# Altium schematic sheet Steering Wheel Schematic.SchDoc
size 447 x 345 mm; SheetNumber: 1; SheetTotal: 1
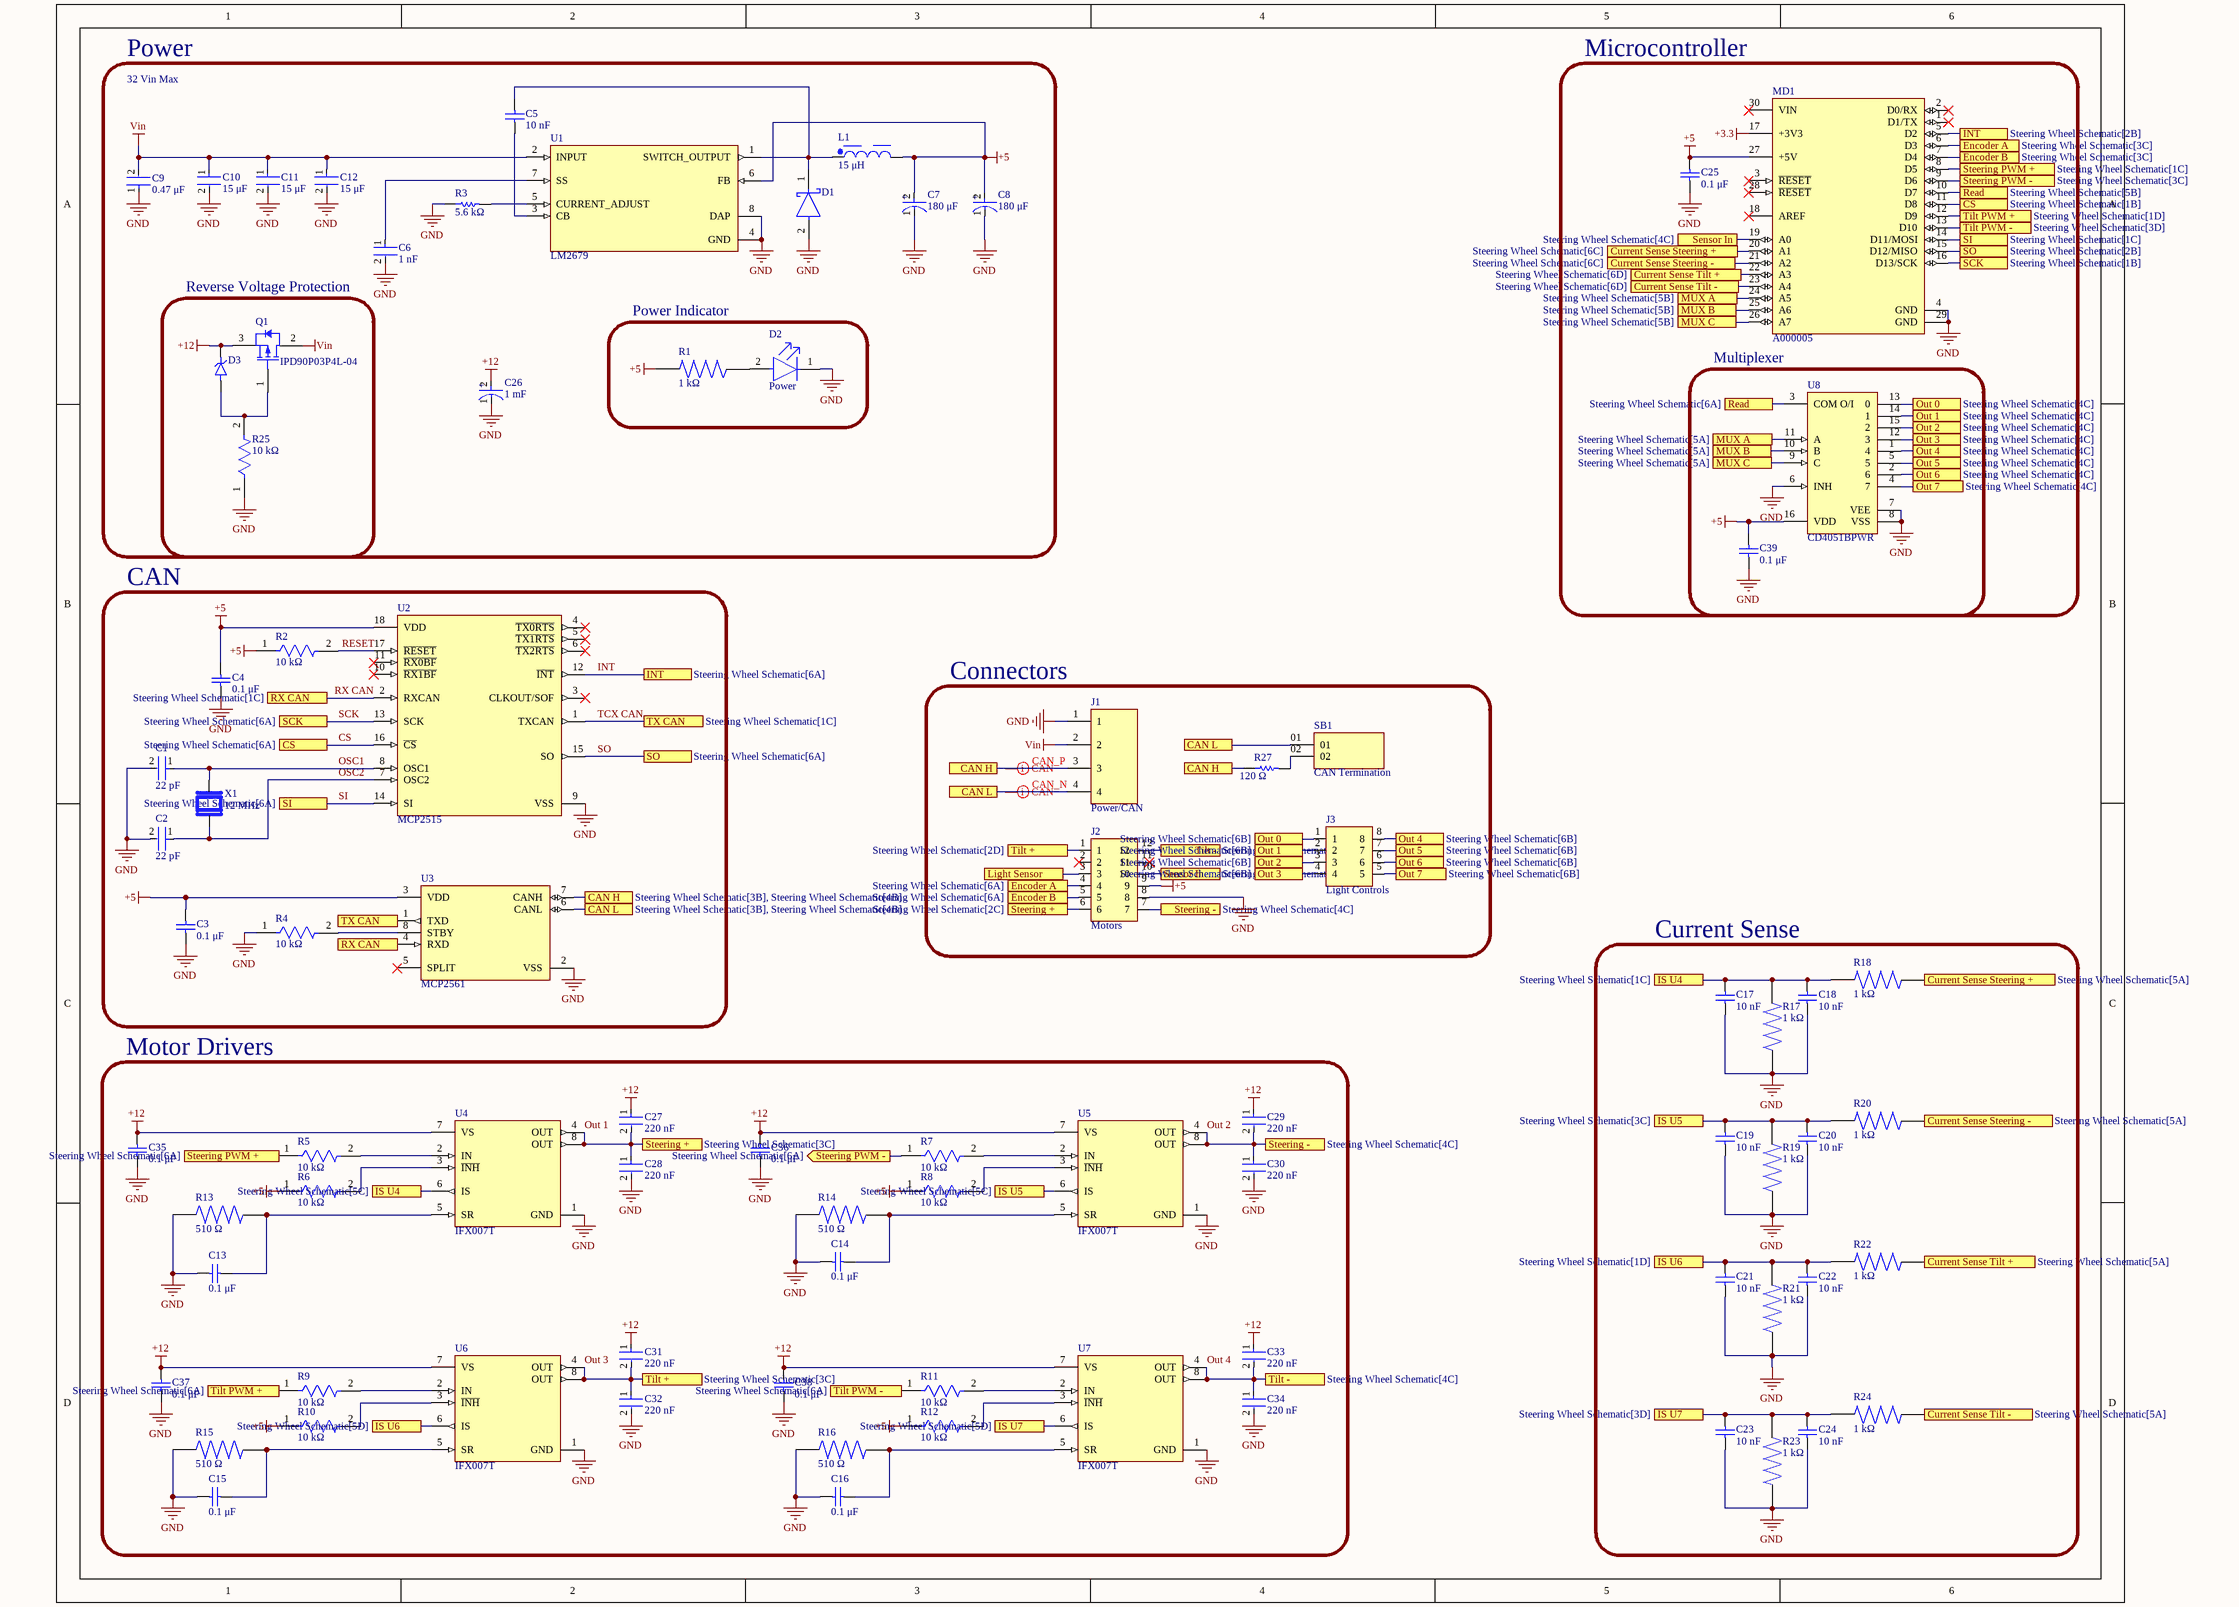
[diagram p0: Steering Wheel Schematic.SchDoc]

## Parts
C1  22 pF  [FP-CL31-IPC_A]
C2  22 pF  [FP-CL31-IPC_A]
C3  0.1 μF  [KEMT-1206-2_M]
C4  0.1 μF  [KEMT-1206-2_M]
C5  10 nF  [WCAP-CSGP_1206_L3.2W1.6H0.8]
C6  1 nF  [FP-C1206C-EF-MFG]
C7  180 μF  [FP-OS-CON-SMT-C6-MFG]
C8  180 μF  [FP-OS-CON-SMT-C6-MFG]
C9  0.47 μF  [FP-C2012-125-0_2-MFG]
C10  15 μF  [FP-C3216-160-0_2-IPC_A]
C11  15 μF  [FP-C3216-160-0_2-IPC_A]
C12  15 μF  [FP-C3216-160-0_2-IPC_A]
C13  0.1 μF  [KEMT-1206-2_M]
C14  0.1 μF  [KEMT-1206-2_M]
C15  0.1 μF  [KEMT-1206-2_M]
C16  0.1 μF  [KEMT-1206-2_M]
C17  10 nF  [WCAP-CSGP_1206_L3.2W1.6H0.8]
C18  10 nF  [WCAP-CSGP_1206_L3.2W1.6H0.8]
C19  10 nF  [WCAP-CSGP_1206_L3.2W1.6H0.8]
C20  10 nF  [WCAP-CSGP_1206_L3.2W1.6H0.8]
C21  10 nF  [WCAP-CSGP_1206_L3.2W1.6H0.8]
C22  10 nF  [WCAP-CSGP_1206_L3.2W1.6H0.8]
C23  10 nF  [WCAP-CSGP_1206_L3.2W1.6H0.8]
C24  10 nF  [WCAP-CSGP_1206_L3.2W1.6H0.8]
C25  0.1 μF  [KEMT-1206-2_M]
C26  1 mF  [FP-FKH13-MFG]
C27  220 nF  [FP-CL31-IPC_C]
C28  220 nF  [FP-CL31-IPC_C]
C29  220 nF  [FP-CL31-IPC_C]
C30  220 nF  [FP-CL31-IPC_C]
C31  220 nF  [FP-CL31-IPC_C]
C32  220 nF  [FP-CL31-IPC_C]
C33  220 nF  [FP-CL31-IPC_C]
C34  220 nF  [FP-CL31-IPC_C]
C35  0.1 μF  [KEMT-1206-2_M]
C36  0.1 μF  [KEMT-1206-2_M]
C37  0.1 μF  [KEMT-1206-2_M]
C38  0.1 μF  [KEMT-1206-2_M]
C39  0.1 μF  [KEMT-1206-2_M]
D1  (no value)  [FP-SOD128-MFG]
D2  Power  [FP-LTST-C190GKT-MFG]
D3  (no value)  [DIOM4325X244N]
J1  Power/CAN  [TE_DT13-4P]
J2  Motors  [TE_DT13-12PA]
J3  Light Controls  [TE_DT13-08PB]
L1  15 μH  [WE-PD_1210]
MD1  A000005  [FP-A000005-MFG]
Q1  IPD90P03P4L-04  [INF-PG-TO252-3-11_M]
R1  1 kΩ  [RESC3116X65N]
R2  10 kΩ  [FP-RMCF1206-IPC_B]
R3  5.6 kΩ  [RESC1206(3216)_L]
R4  10 kΩ  [FP-RMCF1206-IPC_B]
R5  10 kΩ  [FP-RMCF1206-IPC_B]
R6  10 kΩ  [FP-RMCF1206-IPC_B]
R7  10 kΩ  [FP-RMCF1206-IPC_B]
R8  10 kΩ  [FP-RMCF1206-IPC_B]
R9  10 kΩ  [FP-RMCF1206-IPC_B]
R10  10 kΩ  [FP-RMCF1206-IPC_B]
R11  10 kΩ  [FP-RMCF1206-IPC_B]
R12  10 kΩ  [FP-RMCF1206-IPC_B]
R13  510 Ω  [RESC3216X70N]
R14  510 Ω  [RESC3216X70N]
R15  510 Ω  [RESC3216X70N]
R16  510 Ω  [RESC3216X70N]
R17  1 kΩ  [RESC3116X65N]
R18  1 kΩ  [RESC3116X65N]
R19  1 kΩ  [RESC3116X65N]
R20  1 kΩ  [RESC3116X65N]
R21  1 kΩ  [RESC3116X65N]
R22  1 kΩ  [RESC3116X65N]
R23  1 kΩ  [RESC3116X65N]
R24  1 kΩ  [RESC3116X65N]
R25  10 kΩ  [FP-RMCF1206-IPC_B]
R27  120 Ω  [RESC3116X65X40LL10T20]
SB1  CAN Termination  [SAMTEC_TS-102-T-A-2]
U1  LM2679  [VREG_LM2679SX-5.0/NOPB]
U2  MCP2515  [FP-C04-051-MFG]
U3  MCP2561  [FP-C04-057-SN-MFG]
U4  IFX007T  [FP-PG-TO263-7-MFG]
U5  IFX007T  [FP-PG-TO263-7-MFG]
U6  IFX007T  [FP-PG-TO263-7-MFG]
U7  IFX007T  [FP-PG-TO263-7-MFG]
U8  CD4051BPWR  [PW0016A_M]
X1  12 MHz  [XTAL_ABLS7M-12.000MHZ-B-2-T]

## Blocks framed on the sheet
Power: C5-C12 C26 D1 L1 R3 U1
Microcontroller: C25 MD1
Reverse Voltage Protection: D3 Q1 R25
Power Indicator: D2 R1
Multiplexer: C39 U8
CAN: C1-C4 R2 R4 U2 U3 X1
Connectors: J1-J3 R27 SB1
Current Sense: C17-C24 R17-R24
Motor Drivers: C13-C16 C27-C38 R5-R16 U4-U7

## Ports
CAN H (see Steering Wheel Schematic[2C], Steering Wheel Schematic[3B]), CAN H (see Steering Wheel Schematic[2C], Steering Wheel Schematic[4B]), CAN H (see Steering Wheel Schematic[3B], Steering Wheel Schematic[4B]), CAN L (see Steering Wheel Schematic[2C], Steering Wheel Schematic[3B]), CAN L (see Steering Wheel Schematic[2C], Steering Wheel Schematic[4B]), CAN L (see Steering Wheel Schematic[3B], Steering Wheel Schematic[4B]), CS (see Steering Wheel Schematic[1B]), CS (see Steering Wheel Schematic[6A]), Current Sense Steering + (see Steering Wheel Schematic[5A]), Current Sense Steering + (see Steering Wheel Schematic[6C]), Current Sense Steering - (see Steering Wheel Schematic[5A]), Current Sense Steering - (see Steering Wheel Schematic[6C]), Current Sense Tilt + (see Steering Wheel Schematic[5A]), Current Sense Tilt + (see Steering Wheel Schematic[6D]), Current Sense Tilt - (see Steering Wheel Schematic[5A]), Current Sense Tilt - (see Steering Wheel Schematic[6D]), Encoder A (see Steering Wheel Schematic[3C]), Encoder A (see Steering Wheel Schematic[6A]), Encoder B (see Steering Wheel Schematic[3C]), Encoder B (see Steering Wheel Schematic[6A]), INT (see Steering Wheel Schematic[2B]), INT (see Steering Wheel Schematic[6A]), IS U4 (see Steering Wheel Schematic[1C]), IS U4 (see Steering Wheel Schematic[5C]), IS U5 (see Steering Wheel Schematic[3C]), IS U5 (see Steering Wheel Schematic[5C]), IS U6 (see Steering Wheel Schematic[1D]), IS U6 (see Steering Wheel Schematic[5D]), IS U7 (see Steering Wheel Schematic[3D]), IS U7 (see Steering Wheel Schematic[5D]), Light Sensor, MUX A (see Steering Wheel Schematic[5A]), MUX A (see Steering Wheel Schematic[5B]), MUX B (see Steering Wheel Schematic[5A]), MUX B (see Steering Wheel Schematic[5B]), MUX C (see Steering Wheel Schematic[5A]), MUX C (see Steering Wheel Schematic[5B]), Out 0 (see Steering Wheel Schematic[4C]), Out 0 (see Steering Wheel Schematic[6B]), Out 1 (see Steering Wheel Schematic[4C]), Out 1 (see Steering Wheel Schematic[6B]), Out 2 (see Steering Wheel Schematic[4C]), Out 2 (see Steering Wheel Schematic[6B]), Out 3 (see Steering Wheel Schematic[4C]), Out 3 (see Steering Wheel Schematic[6B]), Out 4 (see Steering Wheel Schematic[4C]), Out 4 (see Steering Wheel Schematic[6B]), Out 5 (see Steering Wheel Schematic[4C]), Out 5 (see Steering Wheel Schematic[6B]), Out 6 (see Steering Wheel Schematic[4C]), Out 6 (see Steering Wheel Schematic[6B]), Out 7 (see Steering Wheel Schematic[4C]), Out 7 (see Steering Wheel Schematic[6B]), Read (see Steering Wheel Schematic[5B]), Read (see Steering Wheel Schematic[6A]), RX CAN (see Steering Wheel Schematic[1B]), RX CAN (see Steering Wheel Schematic[1C]), SCK (see Steering Wheel Schematic[1B]), SCK (see Steering Wheel Schematic[6A]), Sensor In (see Steering Wheel Schematic[4C]), Sensor In (see Steering Wheel Schematic[5A]), SI (see Steering Wheel Schematic[1C]), SI (see Steering Wheel Schematic[6A]), SO (see Steering Wheel Schematic[2B]), SO (see Steering Wheel Schematic[6A]), Steering + (see Steering Wheel Schematic[2C]), Steering + (see Steering Wheel Schematic[3C]), Steering - (see Steering Wheel Schematic[4C]), Steering PWM + (out, see Steering Wheel Schematic[6A]), Steering PWM + (see Steering Wheel Schematic[1C]), Steering PWM - (out, see Steering Wheel Schematic[6A]), Steering PWM - (see Steering Wheel Schematic[3C]), Tilt + (see Steering Wheel Schematic[2D]), Tilt + (see Steering Wheel Schematic[3C]), Tilt - (see Steering Wheel Schematic[4C]), Tilt - (see Steering Wheel Schematic[4D]), Tilt PWM + (out, see Steering Wheel Schematic[6A]), Tilt PWM + (see Steering Wheel Schematic[1D]), Tilt PWM - (out, see Steering Wheel Schematic[6A]), Tilt PWM - (see Steering Wheel Schematic[3D]), TX CAN (see Steering Wheel Schematic[1C]), TX CAN (see Steering Wheel Schematic[2B])

## Nets
+3.3: MD1.17(+3V3)
+5: C3.2 C4.2 C7.2(A) C8.2(A) C25.2 C39.2 J2.9 L1.2 MD1.27(+5V) R1.2 R2.1 R6.1 R8.1 R10.1 R12.1 U1.6(FB) U2.18(VDD) U3.3(VDD) U8.16(VDD)
+12: C26.2(A) C27.1 C29.1 C31.1 C33.1 C35.1 C36.1 C37.1 C38.1 D3.C(K) Q1.3(SOURCE) U4.7(VS) U5.7(VS) U6.7(VS) U7.7(VS)
GND: C1.2 C2.2 C3.1 C4.1 C6.2 C7.1(C) C8.1(C) C9.1 C10.2 C11.2 C12.2 C13.2 C14.2 C15.2 C16.2 C17.1 C18.1 C19.1 C20.1 C21.1 C22.1 C23.1 C24.1 C25.1 C26.1(C) C28.2 C30.2 C32.2 C34.2 C35.2 C36.2 C37.2 C38.2 C39.1 D1.2(A) D2.1(C) J1.1 J2.8 MD1.4(GND) MD1.29(GND) R3.1 R4.1 R13.1 R14.1 R15.1 R16.1 R17.1 R19.1 R21.1 R23.1 R25.1 U1.4(GND) U1.8(DAP) U2.9(VSS) U3.2(VSS) U4.1(GND) U5.1(GND) U6.1(GND) U7.1(GND) U8.6(INH) U8.7(VEE) U8.8(VSS)
Vin: C9.2 C10.1 C11.1 C12.1 J1.2 Q1.2(DRAIN) U1.2(INPUT)
CAN_N: J1.4 SB1.01 U3.6(CANL) ; port CAN L
CAN_P: J1.3 R27.1 U3.7(CANH) ; port CAN H
CS: MD1.11(D8) U2.16(~{CS}) ; port CS
Current Sense Steering +: MD1.20(A1) R18.1 ; port Current Sense Steering +
Current Sense Steering -: MD1.21(A2) R20.1 ; port Current Sense Steering -
Current Sense Tilt +: MD1.22(A3) R22.1 ; port Current Sense Tilt +
Current Sense Tilt -: MD1.23(A4) R24.1 ; port Current Sense Tilt -
Encoder A: J2.4 MD1.6(D3) ; port Encoder A
Encoder B: J2.5 MD1.7(D4) ; port Encoder B
INT: MD1.5(D2) U2.12(~{INT}) ; port INT
IS U4: C17.2 C18.2 R17.2 R18.2 U4.6(IS) ; port IS U4
IS U5: C19.2 C20.2 R19.2 R20.2 U5.6(IS) ; port IS U5
IS U6: C21.2 C22.2 R21.2 R22.2 U6.6(IS) ; port IS U6
IS U7: C23.2 C24.2 R23.2 R24.2 U7.6(IS) ; port IS U7
Light Sensor: J2.3 ; port Light Sensor
MUX A: MD1.24(A5) U8.11(A) ; port MUX A
MUX B: MD1.25(A6) U8.10(B) ; port MUX B
MUX C: MD1.26(A7) U8.9(C) ; port MUX C
OSC1: C1.1 U2.8(OSC1) X1.2
OSC2: C2.1 U2.7(OSC2) X1.1
Out 0: J3.1 U8.13(0) ; port Out 0
Out 1: C27.2 C28.1 J2.6 U4.4(OUT) U4.8(OUT) ; port Steering +
Out 1: J3.2 U8.14(1) ; port Out 1  [a separate net that carries the same name]
Out 2: C29.2 C30.1 J2.7 U5.4(OUT) U5.8(OUT) ; port Steering -
Out 2: J3.3 U8.15(2) ; port Out 2  [a separate net that carries the same name]
Out 3: C31.2 C32.1 J2.1 U6.4(OUT) U6.8(OUT) ; port Tilt +
Out 3: J3.4 U8.12(3) ; port Out 3  [a separate net that carries the same name]
Out 4: C33.2 C34.1 J2.12 U7.4(OUT) U7.8(OUT) ; port Tilt -
Out 4: J3.8 U8.1(4) ; port Out 4  [a separate net that carries the same name]
Out 5: J3.7 U8.5 ; port Out 5
Out 6: J3.6 U8.2(6) ; port Out 6
Out 7: J3.5 U8.4(7) ; port Out 7
Read: MD1.10(D7) U8.3(COM_O/I) ; port Read
RESET: R2.2 U2.17(~{RESET})
RX CAN: U2.2(RXCAN) U3.4(RXD) ; port RX CAN
SCK: MD1.16(D13/SCK) U2.13(SCK) ; port SCK
Sensor In: J2.10 MD1.19(A0) ; port Sensor In
SI: MD1.14(D11/MOSI) U2.14(SI) ; port SI
SO: MD1.15(D12/MISO) U2.15(SO) ; port SO
Steering PWM +: MD1.8(D5) R5.1 ; port Steering PWM +
Steering PWM -: MD1.9(D6) R7.1 ; port Steering PWM -
TCX CAN: U2.1(TXCAN) U3.1(TXD) ; port TX CAN
Tilt PWM +: MD1.12(D9) R9.1 ; port Tilt PWM +
Tilt PWM -: MD1.13(D10) R11.1 ; port Tilt PWM -
NetC5_1: C5.1 U1.3(CB)
NetC5_2: C5.2 D1.1(C) L1.1 U1.1(SWITCH_OUTPUT)
NetC6_1: C6.1 U1.7(SS)
NetC13_1: C13.1 R13.2 U4.5(SR)
NetC14_1: C14.1 R14.2 U5.5(SR)
NetC15_1: C15.1 R15.2 U6.5(SR)
NetC16_1: C16.1 R16.2 U7.5(SR)
NetD2_2: D2.2(A) R1.1
NetD3_A: D3.A Q1.1(GATE) R25.2
NetR3_2: R3.2 U1.5(CURRENT_ADJUST)
NetR4_2: R4.2 U3.8(STBY)
NetR5_2: R5.2 U4.2(IN)
NetR6_2: R6.2 U4.3(~{INH})
NetR7_2: R7.2 U5.2(IN)
NetR8_2: R8.2 U5.3(~{INH})
NetR9_2: R9.2 U6.2(IN)
NetR10_2: R10.2 U6.3(~{INH})
NetR11_2: R11.2 U7.2(IN)
NetR12_2: R12.2 U7.3(~{INH})
NetR27_2: R27.2 SB1.02

Not connected (* = marked no-connect by the designer): J2 2* 11*; MD1 1(D1/TX)* 2(D0/RX)* 3(~{RESET})* 18(AREF)* 28(~{RESET})* 30(VIN)*; U2 3(CLKOUT/SOF)* 4(~{TX0RTS})* 5(~{TX1RTS})* 6(~{TX2RTS})* 10(~{RX1BF})* 11(~{RX0BF})*; U3 5(SPLIT)*

## Layout directives
differential pair: CAN_N, CAN_P

## Notes on the sheet
- 32 Vin Max
- (in symbol CMP-05427-002158-1) +
- (in symbol CMP-05428-001090-1) +

## Library data of the parts
C1 C2 = CMP-13271-001055-1: CL31C220JBCNNNC; Material: Ceramic; Voltage: 50V; Tolerance: 5%; Dielectric: C0G; Temperature Coefficient: 300ppm/°C; Capacitance: 22pF; Packaging: Tape and Reel; Package Quantity: 1; Thickness: 0.039inch; Height: 0.85mm; Radiation Hardening: No; Mount: Surface Mount; Width: 0.063inch; Min Operating Temperature: -55°C; Max Operating Temperature: 125°C; Voltage Rating (DC): 50V; Voltage Rating: 50V; Case/Package: 1206; Case Code (Metric): 3216; Length: 3.2mm; Lead Free: Lead Free; Depth: 1.6mm; Case Code (Imperial): 1206
C3 C4 C13-C16 C25 C35-C39 = CMP-1037-04202-2: C1206C104K5RACTU; Manufacturer: Kemet; Voltage Rating: 50V; Capacitance: 0.1µF; Product Range: KEMET-CSeries; SVHC: ToBeAdvised; Capacitance Tolerance: ±10%; Dielectric Characteristic: X7R; Capacitor Case Style: 1206[3216Metric]; Package Reference: 1206-2; Package Description: 2-Leads SMD, Body 3.2 x 1.6 mm; Packaging: Tape&Reel; Operating Temperature Max: 125degC; Datasheet URL: https://datasheet.ciiva.com/6125/1725438-6125494.pdf; Manufacturer URL: http://www.kemet.com/; Operating Temperature Min: -55degC; Datasheet Version: Jul-13
C5 C17-C24 = CMP-03913-65419899-1: 885012208026; Voltage Rating (DC): 16V; Insulation Resistance: 10GΩ; Dielectric: X7R; Tolerance: 10%; Capacitance: 10nF; Case Code (Metric): 3216; Min Operating Temperature: -55°C; Case Code (Imperial): 1206; Length: 3.2mm; Case/Package: 1206; Mount: Surface Mount; RoHS: Compliant; Voltage Rating: 16V; Max Operating Temperature: 125°C; Thickness: 889µm; Height: 800µm; Width: 1.6mm; NexarPartId: 65419899
C6 = CMP-03020-034681-1: C1206C102KGRACTU; Voltage: 2kV; Tolerance: 10%; Dielectric: X7R; Capacitance: 1nF; Dissipation Factor: 2.5%; Dielectric Material: Ceramic; Voltage Rating (DC): 2.5kV; REACH SVHC: No SVHC; Height: 1.6mm; Construction: Flat; Case/Package: 1206; Series: C; Mount: Surface Mount; RoHS Compliant: Yes; Package Quantity: 1; Length: 3.2mm; Width: 0.063inch; Voltage Rating: 2kV; Min Operating Temperature: -55°C; Case Code (Metric): 3216; Termination: SMD/SMT; Number of Pins: 2; Case Code (Imperial): 1206; Packaging: Tape and Reel; Thickness: 0.069inch; Depth: 1.6mm; Radiation Hardening: No; Max Operating Temperature: 125°C
C7 C8 = CMP-05428-001090-1: 16SVPF180M; Polarity: Polar; Capacitance: 180uF; Tolerance: 20%; Dissipation Factor: 12%; Ripple Current: 3.3A; Voltage Rating: 16V; ESR (Equivalent Series Resistance): 22mR; Leakage Current: 576uA; Life (Hours): 5000Hour; Min Operating Temperature: -55°C; REACH SVHC: No SVHC; Height: 5.9mm; Case/Package: Radial; Packaging: Tape and Reel; Termination: SMD/SMT; Max Operating Temperature: 105°C; Package Quantity: 1; RoHS Compliant: Yes; Number of Pins: 6; Lead Free: Lead Free; Mount: Surface Mount; Length: 5.9mm; Height - Seated (Max): 0.236inch; Voltage Rating (DC): 16V; Radiation Hardening: No; Voltage: 16V; Diameter: 6.3mm; Series: OS-CON™, SVPF; Ripple Current (AC): 3.3A; Construction: Cylindrical
C9 = CMP-08246-004925-1: CL31B474KBHNNNE; Dielectric Material: Ceramic; Voltage Rating (DC): 35V; Capacitance: 470nF; Tolerance: 10%; Mount: Surface Mount; Case Code (Imperial): 0805; Series: C; Min Operating Temperature: -55°C; Max Operating Temperature: 125°C; Width: 0.049inch; Lead Free: Lead Free; RoHS Compliant: Yes; Packaging: Tape and Reel; Case Code (Metric): 2012; Case/Package: 0805; Length: 0.079inch; Voltage Rating: 35V; Package Quantity: 2000; Thickness: 0.057inch
C10-C12 = CMP-08246-003750-1: C3216X5R1V156M160AC; Tolerance: 20%; Dielectric: X5R; Dielectric Material: Ceramic; Voltage Rating: 35V; Capacitance: 15uF; Width: 0.063inch; Packaging: Tape and Reel; Max Operating Temperature: 85°C; Resistor Type: Ceramic; Case Code (Imperial): 1206; Case/Package: 1206; RoHS Compliant: Yes; Length: 0.126inch; Mount: Surface Mount; Series: C; Termination: SMD/SMT; Min Operating Temperature: -55°C; Lead Free: Lead Free; Voltage Rating (DC): 35V; Package Quantity: 2000; Height: 1.6mm; Thickness: 0.071inch; Case Code (Metric): 3216
C26 = CMP-05427-002158-1: EEE-FK1E102AQ; Impedance: 60mR; Voltage Rating (DC): 25V; Ripple Current: 1.1A; Life (Hours): 5000Hour; Capacitance: 1mF; Polarity: Polar; Tolerance: 20%; Radiation Hardening: No; Package Quantity: 200; Lead Free: Lead Free; ESR (Equivalent Series Resistance): 60mR; RoHS Compliant: Yes; Height - Seated (Max): 0.55inch; Reach SVHC Compliant: Yes; Min Operating Temperature: -55°C; Packaging: Tape and Reel; Diameter: 12.5mm; Ripple Current (AC): 1.1A; Length: 13.5mm; Voltage: 25V; Mount: Surface Mount; Termination: SMD/SMT; Height: 13.5mm; Voltage Rating: 25V; Max Operating Temperature: 105°C; Series: FK; Construction: Cylindrical; Case/Package: Radial; Ratings: AEC-Q200
C27-C34 = CMP-13271-001294-1: CL31B224KBFNNNE; Material: Ceramic; Voltage: 50V; Dielectric: X7R; Capacitance: 220nF; Tolerance: 10%; Width: 0.063inch; Case Code (Metric): 3216; Packaging: Tape and Reel; Length: 3.2mm; Case/Package: 1206; Case Code (Imperial): 1206; Lead Free: Lead Free; Radiation Hardening: No; Mount: Surface Mount; Voltage Rating (DC): 50V; Voltage Rating: 50V; Max Operating Temperature: 125°C; Height: 1.25mm; Package Quantity: 1; Depth: 1.6mm; Min Operating Temperature: -55°C; Thickness: 0.055inch
D1 = CMP-14398-000032-1: DIODE SCHOTTKY 30V 5A SOD128; RoHS Compliant: Yes
D2 = CMP-22017-000005-2: LTST-C190TGKT; Dominant Wavelength: 569nm; Reverse Voltage: 5V; Lens Style: Clear; Lens Color: Colorless; Viewing Angle: 130°; Voltage: 2V; Forward Current: 30mA; Power Dissipation: 100mW; Luminous Intensity: 6mcd; Number of LEDs: 1; Forward Voltage: 2.1V; Wavelength: 565nm; Illumination Color: Green; Test Current: 10mA; Min Operating Temperature: -55°C; Mount: Surface Mount; Width: 0.8mm; Packaging: Tape and Reel; Lens Transparency: Clear; Case Code (Metric): 1608; Depth: 0.8mm; Case Code (Imperial): 0603; Case/Package: 0603; Number of Pins: 2; Max Operating Temperature: 85°C; Lead Free: Lead Free; Number of Elements: 1; Length: 1.6mm; Height: 0.8mm; Package Quantity: 1; Power Rating: 100mW; Radiation Hardening: No; Color: Green
D3 = 3SMAJ5925B-TP: MF: {'manufacturer': u'Micro Commercial Components'}; Package: None; Price: None; Value: *; MP: 3SMAJ5925B-TP; Availability: Unavailable
J1 = DT13-4P: MF: {'manufacturer': u'TE Connectivity'}; Package: None; Price: None; Value: *; MP: DT13-4P; Availability: Unavailable
J2 = DT13-12PA: MF: {'manufacturer': u'TE Connectivity'}; Package: None; Price: None; Value: *; MP: DT13-12PA; Availability: Unavailable
J3 = DT13-08PB: MF: {'manufacturer': u'TE Connectivity'}; Package: None; Price: None; Value: *; MP: DT13-08PB; Availability: Unavailable
L1 = CMP-0227-00106-2: 7447709150; NexarPartId: 8917162; Max DC Current: 6.5A; Series Resistance: 26mΩ; Inductance: 15µH; Test Frequency: 1kHz; Core Material: Ferrite; Tolerance: 20%; Shielding: Shielded; Self Resonant Frequency: 17MHz; DC Resistance (DCR): 21mΩ; Saturation Current: 8A; Case/Package: Nonstandard; Composition: Wirewound; Case Code (Imperial): 1210; Width: 12mm; Termination: SMD/SMT; Resistance: 26mΩ; Max Operating Temperature: 125°C; Weight: 9.071847g; Min Operating Temperature: -40°C; Current Rating: 6.5A; Lead Free: Lead Free; Depth: 12mm; Mount: Surface Mount; Height - Seated (Max): 10.0076mm; Packaging: Cut Tape (CT); Case Code (Metric): 3225; Length: 12mm; Ambient Temperature Range High: 85°C; REACH SVHC: Unknown; Ambient Temperature Range Low: -40°C; Lead Pitch: 7mm; RoHS: Compliant; Number of Pins: 2; Inductance Tolerance: 20%; Height: 10mm; RMS Current (Irms): 6.5A
MD1 = CMP-189986-000002-1: ARDUINO NANO ATMEGA328 EVAL BRD; Number of Bits: 8; Evaluation Kit: Yes; Operating Supply Voltage: 12V; Interface: I2C; Data Bus Width: 8b; Core Architecture: AVR; Packaging: Bulk; Length: 7inch; Package Quantity: 50; Width: 5inch; REACH SVHC: No SVHC; Weight: 0.358383oz; Series: AVR® ATmega; Height: 0.25inch
Q1 = CMP-1138-00142-1: OptiMOS-P2 Power-Transistor, -30 V VDS, -90 A ID, PG-TO252-3-11, Reel, Green; Manufacturer: Infineon; IDpuls (max): -360 A; RthJC (max): 1.1 K/W; VDS (max): -30 V; Ptot (max): 137 W; RDS (on) (max) (@4.5V): 6.8 mOhm; VGS(th) (min): -1 V; QG: 125 nC; Green: TRUE; ID (max): -90 A; VGS(th) (max): -2 V; RDS (on) (max) (@10V): 4.1 mOhm; ComponentLink3URL: http://www.infineon.com/dgdl/BTS142_DS_13.pdf?folderId=db3a3043163797a6011667aa084c0e01&fileId=db3a3043163797a6011667ac98be0e02&location=en.Products.Automotive_ICs.Smart_High-_and_Low-Side_Switches.HITFET___TEMPFET__-_Smart_Low-Side_Switches.DATASHEET.BTS1; ComponentLink3Description: Package Specification; Halogen-free: TRUE; Mounting Technology: Surface Mount; Packing: Reel; DatasheetVersion: Rev. 1.0; ComponentLink2URL: http://www.infineon.com/dgdl/IPD90P03P4L-04_DS_10.pdf?folderId=db3a304314dca3890114ef902baa05f9&fileId=db3a30431ddc9372011e07e8373a27c4&location=en.Products.Automotive_ICs.Automotive_MOSFETs.Single__P-Channel_30V_MOSFETs.DATASHEET.IPD90P03P4L-04_DS_10.pdf; PackageDescription: 3-Pin Plastic (Green) Transistor Single Outline Package, 6.5 x 6.12 mm Body, 2.28 mm Pitch; ComponentLink2Description: Datasheet; PackageVersion: Dec-06; ComponentLink1Description: Manufacturer URL; Technology: OptiMOS-P2; PackageReference: PG-TO252-3-11; PartNumber: IPD90P03P4L-04; ComponentLink1URL: http://www.infineon.com/
R1 R17-R24 = RT1206DRE071KL: MF: {'manufacturer': u'Yageo'}; Package: None; Price: None; Value: *; MP: RT1206DRE071KL; Availability: Unavailable
R2 R4-R12 R25 = CMP-26527-000151-1: RMCF1206FT10K0; Resistance: 10kR; Temperature Coefficient: 100ppm/°C; Tolerance: 1%; Max Power Dissipation: 250mW; Packaging: Tape and Reel; Resistor Type: Thick Film; Number of Terminations: 2; Depth: 1.6mm; Military Standard: Not; Contact Plating: Tin; Radiation Hardening: No; Lead Free: Lead Free; Length: 3.2mm; Size Code: 1206; RoHS Compliant: Yes; Case/Package: 1206; Mount: Surface Mount; Features: Automotive AEC-Q200; Min Operating Temperature: -55°C; Series: RMCF; Case Code (Imperial): 1206; Construction: Rectangular; Max Operating Temperature: 155°C; Width: 0.063inch; Height: 0.028inch; Power Rating: 250mW; Case Code (Metric): 3216
R3 = CMP-1014-00092-1: RC1206JR-075K6L; Value: 5600.00 Ohm; Case-Metric: 3216; Power: 0.25 W; Tolerance: 5 %; Case-EIA: 1206; Technology: SMT
R13-R16 = RMCF1206FT510R: MF: {'manufacturer': u'Stackpole Electronics Inc'}; Package: None; Price: None; Value: *; MP: RMCF1206FT510R; Availability: Unavailable
R27 = CMP-2000-06965-1: RC1206FR-07120RL; Manufacturer: Yageo; Resistor Element Type: ThickFilm; Resistance Tolerance: ±1%; Resistance: 120ohm; Voltage Rating: 200V; Temperature Coefficient: ±100ppm/°C; Power Rating: 250mW; Product Range: RCSeries; SVHC: ToBeAdvised; Resistor Case Style: 1206[3216Metric]; Package Reference: 1206; Package Description: 2-Pin Surface Mount Device, Body 3.1 x 1.6 mm; Manufacturer URL: http://www.yageo.com/; MSL: MSL1-Unlimited; Packaging: CutTape; Datasheet URL: http://www.yageo.com/documents/recent/PYu-RC_Group_51_RoHS_L_7.pdf; Mounting Technology: SurfaceMount; Datasheet Version: Rev. 7, 05/2017
SB1 = TS-102-T-A-2: MF: {'manufacturer': u'Samtec'}; Package: None; Price: None; Value: *; MP: TS-102-T-A-2; Availability: Unavailable
U1 = LM2679SX-5.0/NOPB: MF: {'manufacturer': u'Texas Instruments'}; Package: None; Price: None; Value: *; MP: LM2679SX-5.0/NOPB; Availability: Unavailable
U2 = CMP-0186-00133-3: MCP2515-I/SO; Manufacturer: Microchip; Min Supply Voltage: 2.7V; Function: Controller; Max Supply Voltage: 5.5V; Standoff Height: 0.1mm; Nominal Supply Current: 10mA; Interface: SPI,CAN; Lead Free: Yes; Digikey Description: IC CAN CONTROLLER W/SPI 18SOIC; Category: IC; RoHS: TRUE; Manufacturer Part Number: MCP2515-I/SO; ComponentLink2URL: http://ww1.microchip.com/downloads/en/DeviceDoc/MCP2515-Stand-Alone-CAN-Controller-with-SPI-20001801J.pdf; Mouser Description: CAN Interface IC W/ SPI Interface; Device Class L2: Interface ICs; Package: C04-051; Automotive: No; Octopart: https://octopart.com/mcp2515-i%2Fso-microchip-430187; Temperature: -40°C to +85°C; Ipc Land Pattern Name: SOIC127P1030X265-18; Ambient Temperature Range Low: -65°C; Height: 2.65mm; Device Class L1: Integrated Circuits (ICs); Ambient Temperature Range High: +125°C; Footprint Url: http://ww1.microchip.com/downloads/en/DeviceDoc/18L_SOIC_Wide_7.50_SO_C04-0051D.pdf; Temperature Range Low: -40°C; Device Class L3: Controllers; Temperature Range High: +85°C; ComponentLink2Description: Datasheet
U3 = CMP-06279-000064-1: MCP2561FDT-E/SN; Data Rate: 8Mbps; Operating Supply Current: 70mA; Max Supply Voltage: 5.5V; Number of Transceivers: 1; Receiver Hysteresis: 200mV; Min Supply Voltage: 4.5V; Case/Package: SOIC; Mount: Surface Mount; Weight: 0.019048oz; Min Operating Temperature: -40°C; Package Quantity: 3300; Series: -; Packaging: Tape and Reel; Max Operating Temperature: 125°C; RoHS Compliant: Yes; Number of Pins: 8
U4-U7 = CMP-32854-000005-1: IFX007TAUMA1; Manufacturer: Infineon; Number Of Outputs: 1; Nominal Supply Current: 2.3mA; Min Supply Voltage: 8V; Standoff Height: 0.1mm; Max Junction Temp: +150°C; Max Supply Voltage: 40V; Temperature: -40°C to +150°C; ComponentLink2Description: Datasheet; Category: IC; Mouser Description: integrated high current half bridge for motor drive applications; Automotive: No; Digikey Description: IC HALF-BRIDGE DRVR 2 CH TO263; Height: 4.5mm; Package: PG-TO263-7; ComponentLink2URL: https://www.infineon.com/dgdl/Infineon-IFX007T-DS-v01_00-EN.pdf?fileId=5546d46265f064ff0166433484070b75; RoHS: TRUE; Device Class L3: Motor Drivers; Manufacturer Part Number: IFX007TAUMA1; Device Class L2: Power Management ICs; Temperature Range Low: -40°C; Lead Free: Yes; Footprint Url: https://www.infineon.com/cms/en/product/packages/PG-TO263/PG-TO263-7-1/; Octopart: https://octopart.com/ifx007tauma1-infineon-94578162; Temperature Range High: +150°C; Device Class L1: Integrated Circuits (ICs)
U8 = CMP-1575-00083-4: CMOS Single 8-Channel Analog Multiplexer/Demultiplexer with Logic-Level Conversion, PW0016A, LARGE T&R; Manufacturer: Texas Instruments; Bandwidth(Max)(MHz): 20; Ron(Max)(Ohms): 240; Ron(Typ)(Ohms): 125; Output Drive (IOL/IOH)(Max)(mA): 1; ICC(Typ)(mA): 0.00008; Rating: Military; VCC(Max)(V): 18; Configuration: 1 X 1：8 MUX; VCC(Min)(V): 5; Crosstalk: Yes; PackageVersion: http://www.ti.com/lit/ml/mpds361/mpds361.pdf; DatasheetVersion: SCHS047G; Code_JEDEC: MO-153; Operating Temperature Range(C): -55 to 125; PackageReference: PW0016A; Output Type: CMOS; Generic Part Number: CD4051B
X1 = ABLS7M-12.000MHZ-B-2-T: MF: {'manufacturer': u'Abracon LLC'}; Package: None; Price: None; Value: *; MP: ABLS7M-12.000MHZ-B-2-T; Availability: Unavailable